# Altium schematic sheet BlockAmpli_LED.SchDoc: <title>
size A4; Organization: Institut d'Automatisation Industrielle; SheetNumber: 5; SheetTotal: 8; SVN: OUI; CurrentTime: 6; CurrentDate: 5; DocumentFullPathAndName: 8; DocumentName: 9; ModifiedDate: 13; ProjectName: <projet>
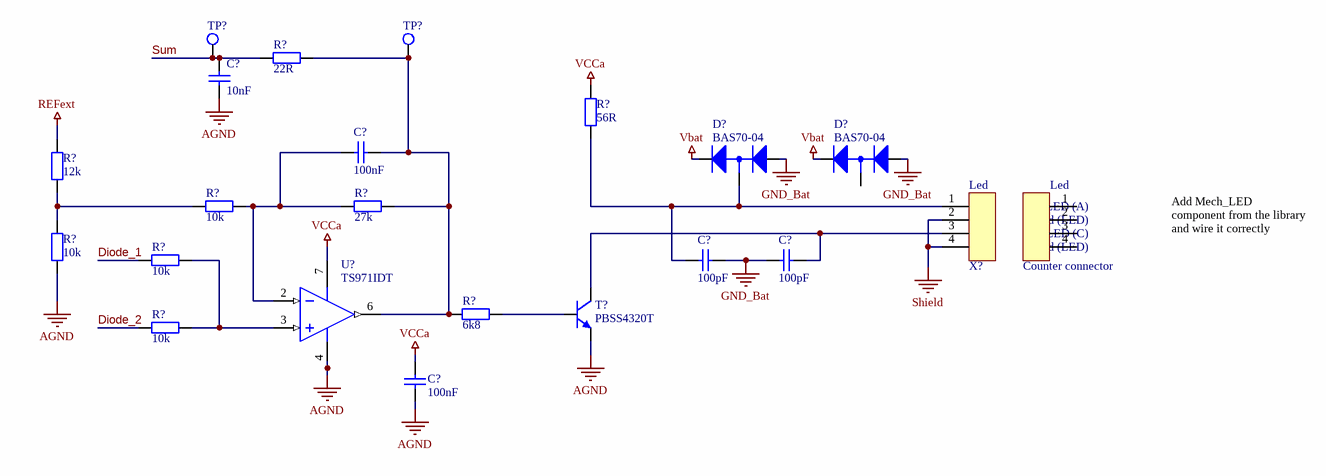
[diagram p0: BlockAmpli_LED.SchDoc]

## Parts
(Parts that share a designator on the sheet are numbered #1, #2 ... from top to bottom, then left to right.)
C?#1  10nF  [CAPC2012N]
C?#2  100nF  [CAPC2012N]
C?#3  100pF  [CAPC2012N]
C?#4  100pF  [CAPC2012N]
C?#5  100nF  [CAPC2012N]
D?#1  BAS70-04  [SOT23-3N]
D?#2  BAS70-04  [SOT23-3N]
R?#1  22R  [RESC2012N]
R?#2  56R  [RESC2012N]
R?#3  12k  [RESC2012N]
R?#4  10k  [RESC2012N]
R?#5  27k  [RESC2012N]
R?#6  10k  [RESC2012N]
R?#7  10k  [RESC2012N]
R?#8  6k8  [RESC2012N]
R?#9  10k  [RESC2012N]
T?  PBSS4320T  [SOT23-3N]
TP?#1  TP  [Testpoint]  (value not drawn)
TP?#2  TP  [Testpoint]  (value not drawn)
U?  TS971IDT  [SOIC8]
X?  MicroMatch4p  [MicroMatch4p]  (value not drawn)
Y?  Counter connector  (no BOM)

## Nets
AGND: C?#1.1 C?#5.1 R?#7.1 T?.2(E) U?.4(V-)
GND_Bat: C?#3.2 C?#4.1 D?#1.1(A) D?#2.1(A)
REFext: R?#3.2
Shield: X?.2 X?.4
Vbat: D?#1.2(K) D?#2.2(K)
VCCa: C?#5.2 R?#2.2 U?.7(V+)
Diode_1: R?#6.1
Diode_2: R?#9.1
Sum: C?#1.2 R?#1.1 TP?#1.1
NetC?#2_1: C?#2.1 R?#4.2 R?#5.1 U?.2(IN-)
NetC?#2_2: C?#2.2 R?#1.2 R?#5.2 R?#8.1 TP?#2.1 U?.6(OUT)
NetC?#3_1: C?#3.1 D?#1.3(A/K) R?#2.1 X?.1
NetC?#4_2: C?#4.2 T?.3(C) X?.3
NetR?#3_1: R?#3.1 R?#4.1 R?#7.2
NetR?#6_2: R?#6.2 R?#9.2 U?.3(IN+)
NetR?#8_2: R?#8.2 T?.1(B)

Not connected (* = marked no-connect by the designer): D?#2 3(A/K); Y? 1 2 3 4

## Notes on the sheet
- (near X?) Led
- (near Y?) Led
- (near Y?) LED (C)
- (near Y?) Shield (LED)
- (near Y?) LED (A)
- Add Mech_LED component from the library and wire it correctly
- Title
- Institut d'automatisation industrielle
  rte de Cheseaux 1
  CH-1401 Yverdon-les-Bains
  T +41(0)24 55 77 377    F +41(0)24 55 76 320
  http://iai.heig-vd.ch       iai@heig-vd.ch
- Date:
- Size:
- A4
- Project:
- Sheet
- of
- No.
- Author:
- SVN
- Version
- File:

## Library data of the parts
C?#1 = Cap_10nF: Capacitor; Value: 10nF; Supplier 1: Digi-Key; Supplier Part Number 1: 311-1136-1-ND
C?#2 C?#5 = Cap_100nF: Capacitor; Value: 100nF; Supplier 1: Digi-Key; Supplier Part Number 1: 478-1395-1-ND
C?#3 C?#4 = Cap_100pF: Capacitor; Value: 100pF; Supplier 1: Digi-Key; Supplier Part Number 1: 399-1122-1-ND
R?#1 = Res_22R: Resistor; Value: 22R; Supplier 1: Digi-Key; Supplier Part Number 1: 311-22.0CRCT-ND
R?#2 = Res_56R: Resistor; Value: 56R; Supplier 1: Digi-Key; Supplier Part Number 1: 311-56.0CRCT-ND
R?#3 = Res_12k: Resistor; Value: 12k; Supplier 1: Digi-Key; Supplier Part Number 1: 311-12.0KCRCT-ND
R?#4 R?#6 R?#7 R?#9 = Res_10k: Resistor; Value: 10k; Supplier 1: Digi-Key; Supplier Part Number 1: 311-10.0KCRCT-ND
R?#5 = Res_27k: Resistor; Value: 27k; Supplier 1: Digi-Key; Supplier Part Number 1: 311-27.0KCRCT-ND
R?#8 = Res_6k8: Resistor; Value: 6k8; Supplier 1: Digi-Key; Supplier Part Number 1: 311-6.80KCRCT-ND
TP?#1 TP?#2 = TP: =Value; Supplier 1: Digi-Key; Supplier Part Number 1: 36-5006-ND
Y? = MicroMatch4p_Header: Counter connector of MicroMatch4p; Supplier 1: Digi-Key; Supplier Part Number 1: A107022CT-ND
D?#1 D?#2 = BAS70-04: Supplier 1: Digi-Key; Supplier Part Number 1: BAS70-04-FDICT-ND
T? = PBSS4320T: Supplier 1: Digi-Key; Supplier Part Number 1: 568-4157-1-ND
U? = TS971IDT: Supplier 1: Digi-Key; Supplier Part Number 1: 497-6780-1-ND
X? = MicroMatch4p: Supplier 1: Digi-Key; Supplier Part Number 1: A107022CT-ND